# EAGLE design phone_jack_breaklight_Seeed_OPL-with-placements (EAGLE 7.7.0)
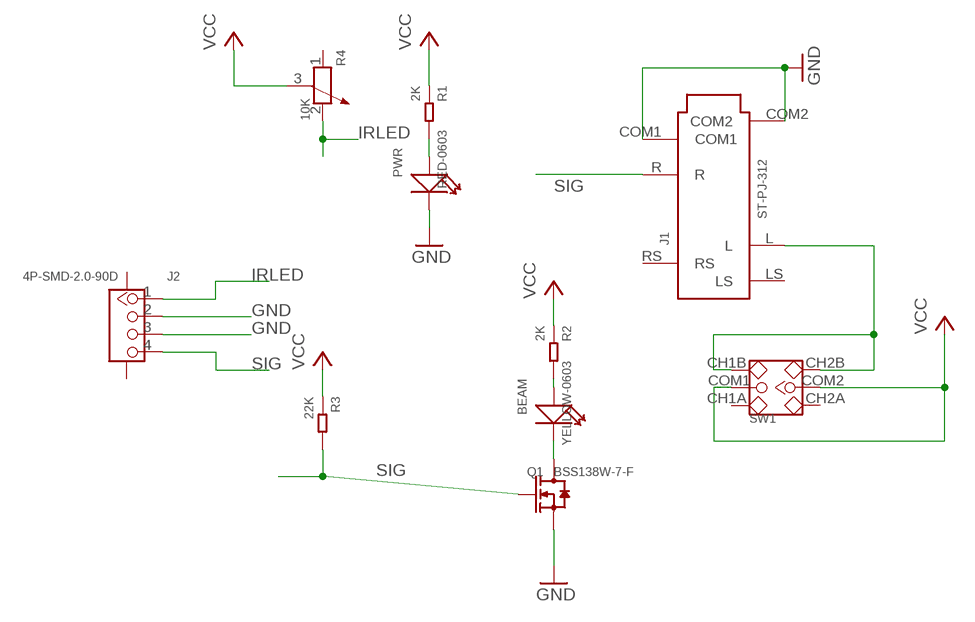
[diagram p0: schematic, sheet 1]

## Parts
J1  ST-PJ-312  AUDIO-JACK-6P-SMD(ST-PJ-312)  [AUDIO6P-SMD-3.5-14.0X6.4X5.0MM]
J2  4P-SMD-2.0-90D  GROVE-CONNECTOR-SMD-90D(4+2P-2.0)  [HW4-SMD-2.0-90D]
Q1  BSS138W-7-F  SMD-MOSFET-N-CH-50V-200MA-BSS138W-7-F(SOT-23)  [SOT-23]
R1  2K  SMD-RES-2K-5%-1/10W(0603)  [R0603]
R2  2K  SMD-RES-2K-5%-1/10W(0603)  [R0603]
R3  22K  SMD-RES-22K-5%-1/10W(0603)  [R0603]
R4  10K  DIP-VR-TOP-ADJ-10K(3P-9.5X9.5X5MM)  [ADJR3-9.5X9.5X10.5MM]
RED-0603  PWR  LED-SMD-RED-DIFFUSED(0603)  [LED-0603]
SW1  DIP-TOGGLE-SWITCH-2CH-(2X3P-2.54-90D)'90D'  [SW6-2.54-9.0X3.5X3.2MM-90D]
YELLOW-0603  BEAM  SMD-LED-CLEAR-YELLOW(0603)  [LED-0603]

## Nets
GND: J1.COM1 J1.COM2 J2.2 J2.3 Q1.2(S) RED-0603.-
IRLED: J2.1 R4.2
N$1: R2.2 YELLOW-0603.+
N$2: J1.L SW1.CH1B SW1.CH2B
N$3: Q1.3(D) YELLOW-0603.-
N$4: R1.2 RED-0603.+
SIG: J1.R J2.4 Q1.1(G) R3.2
VCC: R1.1 R2.1 R3.1 R4.3 SW1.COM1 SW1.COM2
Unconnected: J1.LS J1.RS J2.SS1 J2.SS2 R4.1 SW1.CH1A SW1.CH2A

## Library data of the parts
J1 = Seeed-Connector -2016:AUDIO-JACK-6P-SMD(ST-PJ-312): 320040007; MPN: ST-PJ-312
J2 = Seeed-Connector -2016:GROVE-CONNECTOR-SMD-90D(4+2P-2.0): 320110032
Q1 = Seeed-Transistor-2016:SMD-MOSFET-N-CH-50V-200MA-BSS138W-7-F(SOT-23): 305030000; MPN: BSS138W-7-F
R1 R2 = Seeed-Resistor-2016:SMD-RES-2K-5%-1/10W(0603): 301010113; MPN: RC0603JR-072KL
R3 = Seeed-Resistor-2016:SMD-RES-22K-5%-1/10W(0603): 301010132; MPN: RC0603JR-0722KL
R4 = Seeed-Resistor-2016:DIP-VR-TOP-ADJ-10K(3P-9.5X9.5X5MM): 301040007; MPN: 3386U-103
RED-0603 = Seeed-LED-2016:LED-SMD-RED-DIFFUSED(0603): 304090042; MPN: 19-217-R6C-AL1M2VY-3T; VALUE: RED-0603
SW1 = Seeed-Switch-2016:DIP-TOGGLE-SWITCH-2CH-(2X3P-2.54-90D): 311030004
YELLOW-0603 = Seeed-LED-2016:SMD-LED-CLEAR-YELLOW(0603): 304090044; MPN: 19-217-Y5C-AM1N1VY-3T; VALUE: YELLOW-0603

## Board
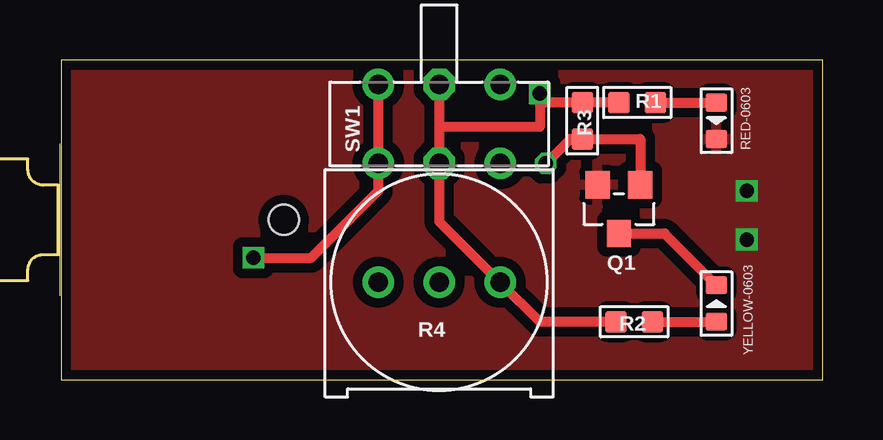
[diagram p1: board, top side]
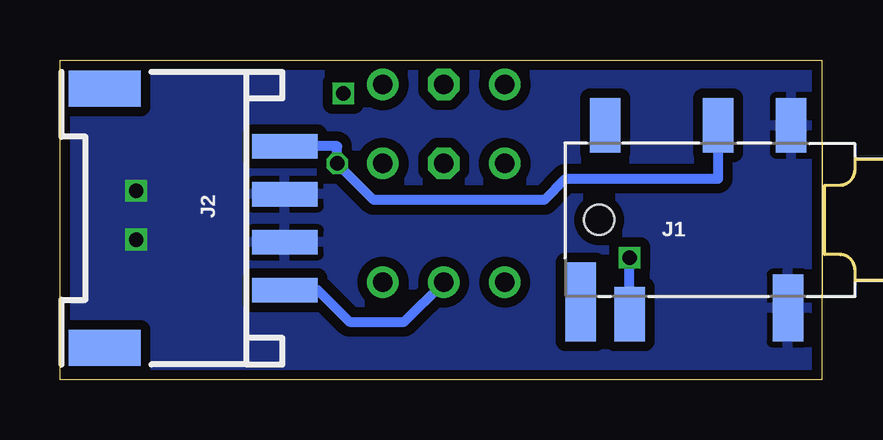
[diagram p2: board, bottom side, seen from below]

Size 31.81 x 13.34 mm. Coordinates in mm from the lower left corner, seen from the top.
Outline: 31.81,0 31.81,13.34 0.06,13.34 0.06,0 31.81,0
Copper layers (1*16): Top 0.035mm / dielectric 1.5mm / Bottom 0.035mm
Design rules "Seeed_DRU": minimum track width 6mil, minimum drill 12mil, track to track 6mil, track to pad 6mil, pad to pad 6mil, via to via 6mil, smd to smd 0mil, copper to edge 10mil, drill to drill 10mil, minimum pad ring 10mil, minimum via ring 6mil, stop-mask expansion 2mil, vias tented up to drill 100mil, thermal gap 10mil

### Footprints (pad centres in the part's own frame; a part is rotated, then mirrored left to right if it is on the bottom)
AUDIO6P-SMD-3.5-14.0X6.4X5.0MM = smd 1.27 x 2.286: COM1 -4.572,3.937; L -11.303,-3.937; R -7.62,3.937; RS -12.319,3.937 | smd 1.27 x 2.794: COM2 -4.699,-3.683 | smd 1.27 x 3.302: LS -13.335,-3.429 | hole 1.27: -12.573,0
HW4-SMD-2.0-90D = smd 1.01 x 2.74: 1 -3,-0.1; 2 -1,-0.1; 3 1,-0.1; 4 3,-0.1 | smd 1.5 x 3: SS1 -5.4,7.4; SS2 5.4,7.4
SOT-23 = smd 1.016 x 1.143: 1 -0.889,-1.016; 2 0.889,-1.016; 3 0,1.016
R0603 = smd 0.889 x 0.889: 1 0,0.762; 2 0,-0.762
ADJR3-9.5X9.5X10.5MM = drill 0.8: 1 -2.54,0; 2 0,0; 3 2.54,0
LED-0603 = smd 0.762 x 0.889: + -0.762,0; - 0.762,0
SW6-2.54-9.0X3.5X3.2MM-90D = drill 0.813 pad 1.27: CH1A -2.54,-1.65; CH1B 2.54,-1.65; CH2A -2.54,1.65; CH2B 2.54,1.65 | drill 0.813 pad 1.27 octagon: COM1 0,-1.65; COM2 0,1.65

### Placement (x,y rotation side)
J1  -3.24,6.67 0 bottom
J2  22.54,6.73 90 bottom
Q1  23.3,7.11 180 top
R1  24.07,11.56 90 top
R2  23.94,2.41 90 top
R3  21.78,10.79 0 top
R4  15.81,4.06 0 top
RED-0603  27.37,10.79 270 top
SW1  15.81,10.67 180 top
YELLOW-0603  27.37,3.17 90 top

### Tracks (layer width: path | path; a pad name or v marks a point on that pad's centre or on a via)
GND  (via drill 0.6)
  other vias: 28.64,5.84 28.64,7.87
  pour Top (isolate 0.406): 0.06,0 31.81,0 31.94,13.34 0.19,13.34
  pour Bottom (isolate 0.406): 0.06,0 31.81,0 31.81,13.34 0.06,13.34
IRLED
  Bottom 0.406: J2.1 21.07,3.73 19.75,2.41 17.46,2.41 R4.2
N$1
  Top 0.406: R2.2 YELLOW-0603.+
N$2  (via drill 0.6)
  Top 0.406: SW1.CH1B SW1.CH2B 13.27,7.87 10.48,5.08 v8.06,5.08
  Bottom 0.406: J1.L v8.06,5.08
N$3
  Top 0.406: Q1.3 25.21,6.1 YELLOW-0603.-
N$4
  Top 0.406: R1.2 RED-0603.+
SIG  (via drill 0.6)
  Top 0.406: Q1.1 24.19,10.03 R3.2 21.27,10.03 v20.26,9.02
  Bottom 0.406: J2.4 20.26,9.73 v20.26,9.02 18.73,7.49 11.62,7.49 10.73,8.38 4.38,8.38 J1.R
VCC  (via drill 0.6)
  Top 0.406: SW1.COM1 15.81,10.54 | 15.81,10.54 20,10.54 v20,11.94 20,11.56 R3.1 R1.1 | 15.81,10.54 SW1.COM2 15.81,6.6 R4.3 20,2.41 R2.1

### Text on the board
tDocu: CK - SDG | ON | BeamBreak / v5.1 (2017) | IR Intensity
bDocu: PHOTOTRANS | GND | IR LED